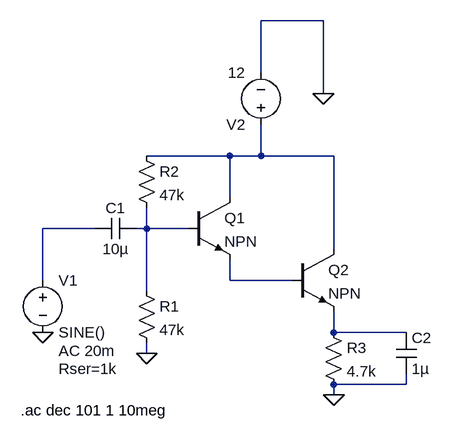
[diagram p0: schematic exp_7_iv_zi-wb-electro.asc]
exp_7_iv_zi-wb-electro.asc, the LTspice schematic file:
Version 4
SHEET 1 880 680
WIRE 432 -208 336 -208
WIRE 336 -128 336 -208
WIRE 432 -96 432 -208
WIRE 288 0 160 0
WIRE 336 0 336 -48
WIRE 336 0 288 0
WIRE 448 0 336 0
WIRE 288 64 288 0
WIRE 80 112 0 112
WIRE 160 112 160 80
WIRE 160 112 144 112
WIRE 224 112 160 112
WIRE 448 144 448 0
WIRE 0 192 0 112
WIRE 288 192 288 160
WIRE 384 192 288 192
WIRE 160 208 160 112
WIRE 448 272 448 240
WIRE 560 272 448 272
WIRE 160 304 160 288
WIRE 560 352 560 336
WIRE 560 352 448 352
WIRE 448 368 448 352
FLAG 160 304 0
FLAG 448 368 0
FLAG 432 -96 0
FLAG 0 272 0
SYMBOL voltage 0 176 R0
WINDOW 123 24 124 Left 2
WINDOW 39 24 152 Left 2
SYMATTR InstName V1
SYMATTR Value SINE()
SYMATTR Value2 AC 20m
SYMATTR SpiceLine Rser=1k
SYMBOL cap 144 96 R90
WINDOW 0 0 32 VBottom 2
WINDOW 3 32 32 VTop 2
SYMATTR InstName C1
SYMATTR Value 10µ
SYMBOL res 144 192 R0
SYMATTR InstName R1
SYMATTR Value 47k
SYMBOL res 144 -16 R0
SYMATTR InstName R2
SYMATTR Value 47k
SYMBOL npn 224 64 R0
SYMATTR InstName Q1
SYMBOL npn 384 144 R0
SYMATTR InstName Q2
SYMBOL cap 544 272 R0
SYMATTR InstName C2
SYMATTR Value 1µ
SYMBOL res 432 256 R0
SYMATTR InstName R3
SYMATTR Value 4.7k
SYMBOL voltage 336 -32 R180
WINDOW 123 0 0 Left 0
WINDOW 39 0 0 Left 0
SYMATTR InstName V2
SYMATTR Value 12
TEXT -34 392 Left 2 !.ac dec 101 1 10meg

The netlist it stands for:
* exp_7_iv_zi-wb-electro.asc
V1 N002 0 SINE() AC 20m Rser=1k
C1 N003 N002 10µ
R1 N003 0 47k
R2 N001 N003 47k
Q1 N001 N003 N004 0 NPN
Q2 N001 N004 N005 0 NPN
C2 N005 0 1µ
R3 N005 0 4.7k
V2 N001 0 12
.model NPN NPN
.model PNP PNP
.lib standard.bjt
.ac dec 101 1 10meg
.backanno
.end